# EAGLE design laserbox-muxboard (EAGLE 6.6.0)

## Sheet 1 of 2: Logic
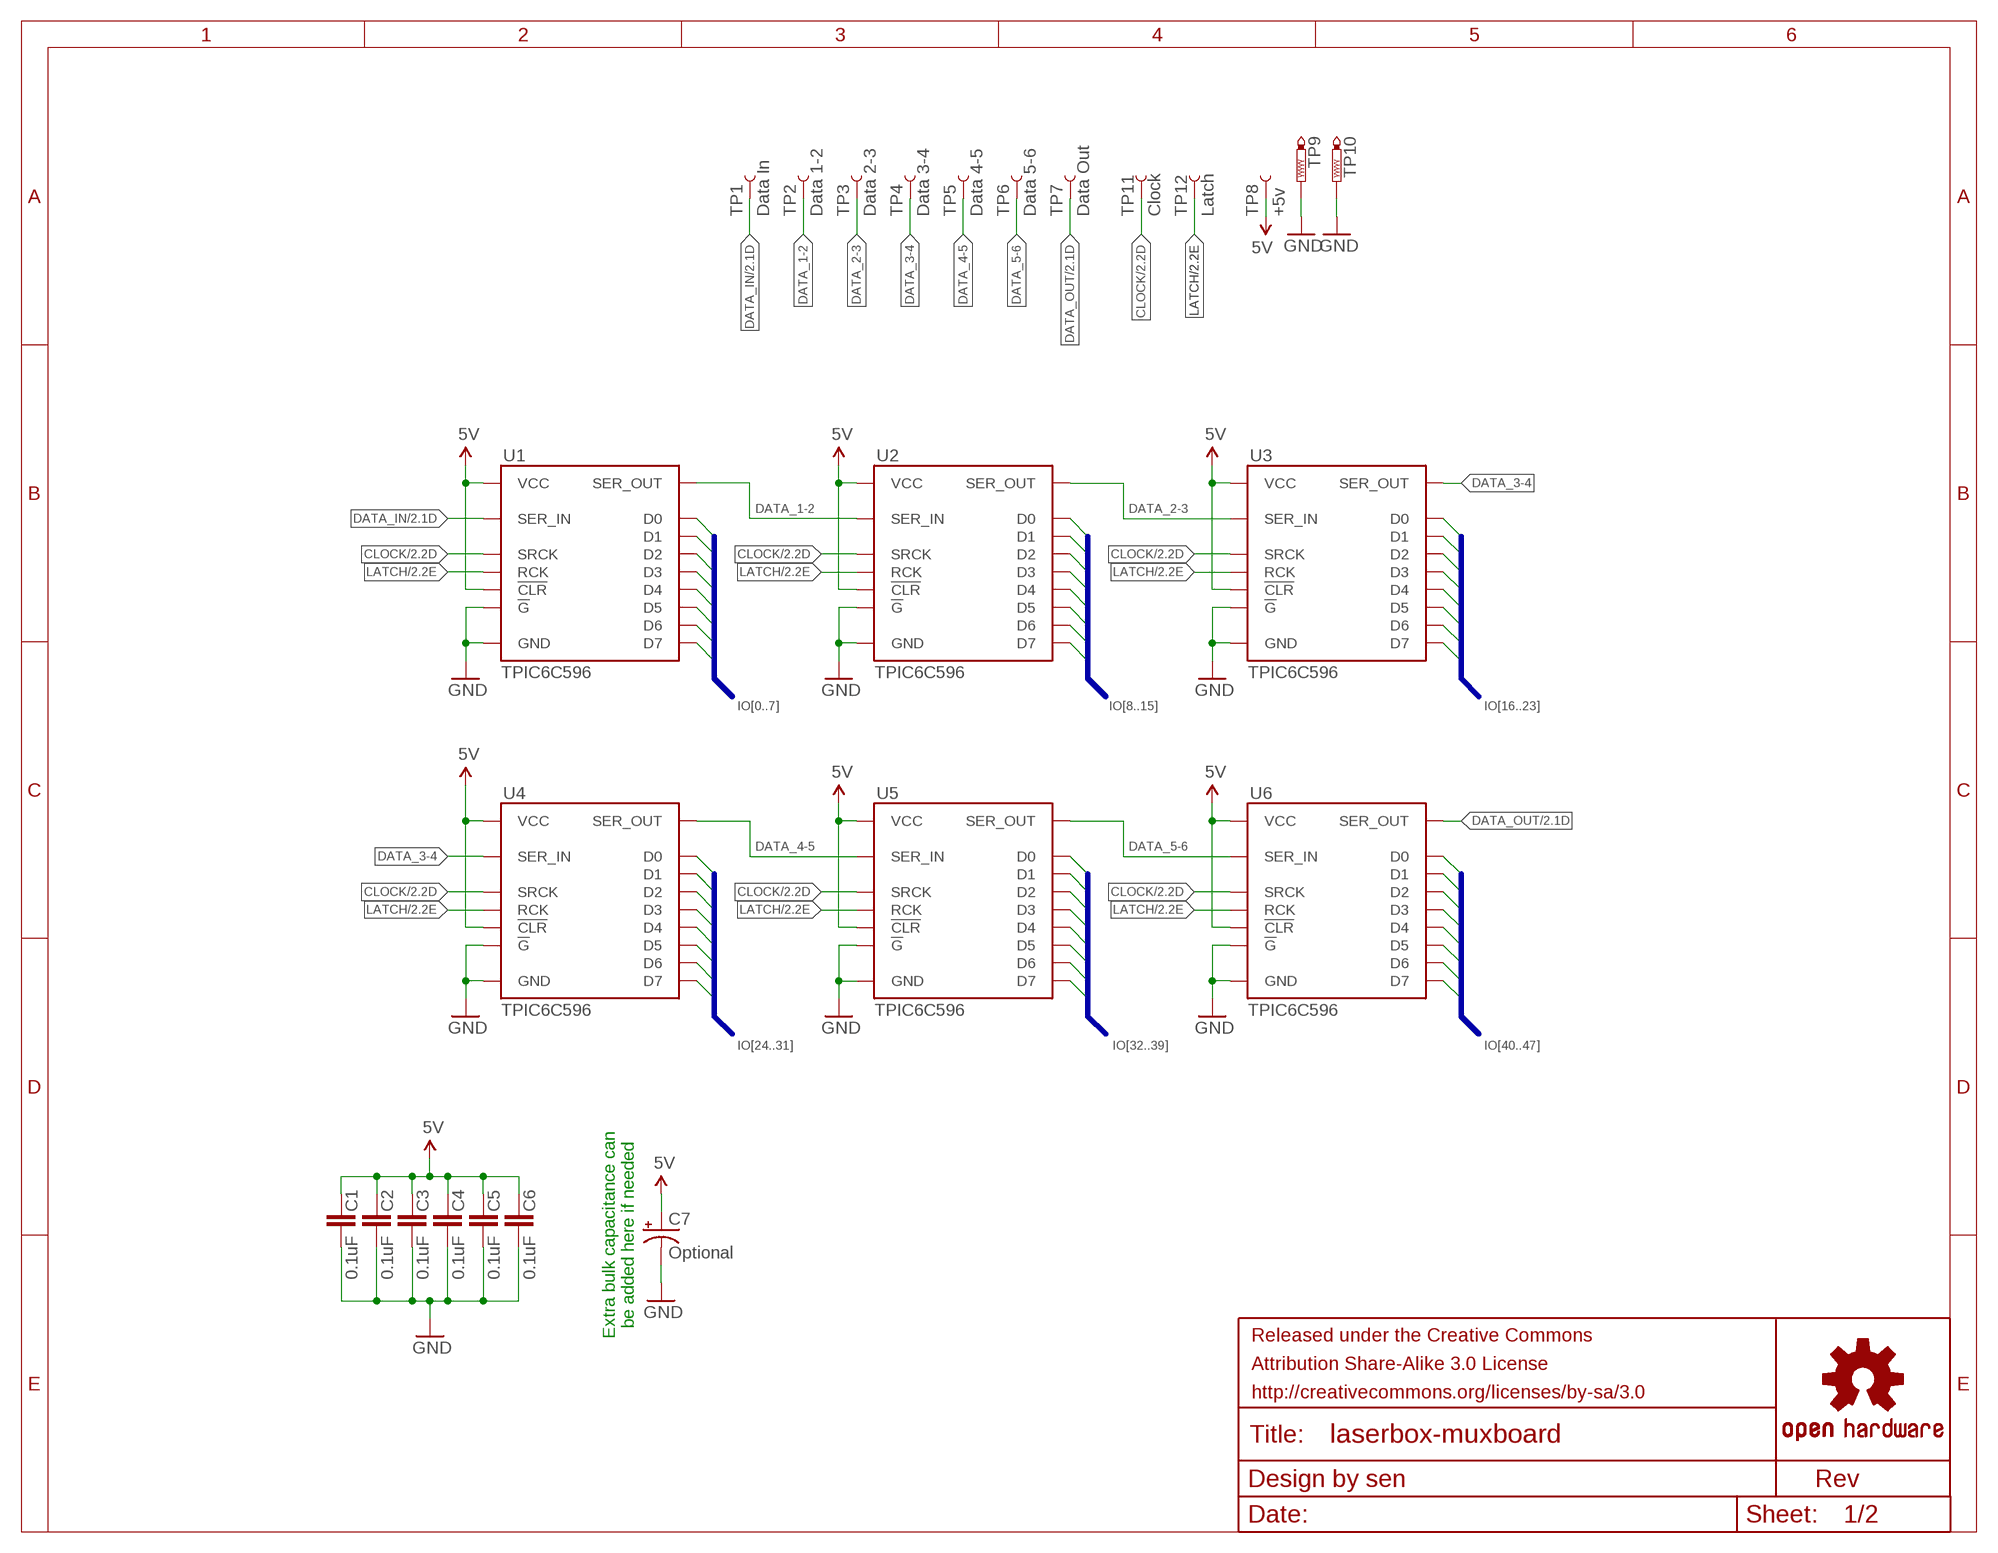
[diagram p0: schematic, sheet 1]

### Parts
C1  0.1uF  0.1UF-25V-5%(0603)  [0603-CAP]
C2  0.1uF  0.1UF-25V-5%(0603)  [0603-CAP]
C3  0.1uF  0.1UF-25V-5%(0603)  [0603-CAP]
C4  0.1uF  0.1UF-25V-5%(0603)  [0603-CAP]
C5  0.1uF  0.1UF-25V-5%(0603)  [0603-CAP]
C6  0.1uF  0.1UF-25V-5%(0603)  [0603-CAP]
C7  Optional  CAP_POLPTH2  [CPOL-RADIAL-10UF-25V]
FRAME1  FRAME-LETTER-GRID-OSHW-SENOSHW-LOGO-L  [OSHW-LOGO-L]
TP1  Data In  TEST-POINT3X5  [PAD.03X.05]
TP2  Data 1-2  TEST-POINT3X5  [PAD.03X.05]
TP3  Data 2-3  TEST-POINT3X5  [PAD.03X.05]
TP4  Data 3-4  TEST-POINT3X5  [PAD.03X.05]
TP5  Data 4-5  TEST-POINT3X5  [PAD.03X.05]
TP6  Data 5-6  TEST-POINT3X5  [PAD.03X.05]
TP7  Data Out  TEST-POINT3X5  [PAD.03X.05]
TP8  +5v  TEST-POINT3X5  [PAD.03X.05]
TP9  GND  PTR1PAD1-13  [P1-13]
TP10  GND  PTR1PAD1-13  [P1-13]
TP11  Clock  TEST-POINT3X5  [PAD.03X.05]
TP12  Latch  TEST-POINT3X5  [PAD.03X.05]
U1  TPIC6C596  TPIC6C596SOIC  [SO016]
U2  TPIC6C596  TPIC6C596SOIC  [SO016]
U3  TPIC6C596  TPIC6C596SOIC  [SO016]
U4  TPIC6C596  TPIC6C596SOIC  [SO016]
U5  TPIC6C596  TPIC6C596SOIC  [SO016]
U6  TPIC6C596  TPIC6C596SOIC  [SO016]

### Nets
5V: C1.1 C2.1 C3.1 C4.1 C5.1 C6.1 C7.1(+) TP8.P$1 U1.1(VCC) U1.7(!CLR) U2.1(VCC) U2.7(!CLR) U3.1(VCC) U3.7(!CLR) U4.1(VCC) U4.7(!CLR) U5.1(VCC) U5.7(!CLR) U6.1(VCC) U6.7(!CLR) ; also sheet 2
CLOCK: TP11.P$1 U1.15(SRCK) U2.15(SRCK) U3.15(SRCK) U4.15(SRCK) U5.15(SRCK) U6.15(SRCK) ; also sheet 2
DATA_1-2: TP2.P$1 U1.9(SER_OUT) U2.2(SER_IN)
DATA_2-3: TP3.P$1 U2.9(SER_OUT) U3.2(SER_IN)
DATA_3-4: TP4.P$1 U3.9(SER_OUT) U4.2(SER_IN)
DATA_4-5: TP5.P$1 U4.9(SER_OUT) U5.2(SER_IN)
DATA_5-6: TP6.P$1 U5.9(SER_OUT) U6.2(SER_IN)
DATA_IN: TP1.P$1 U1.2(SER_IN) ; also sheet 2
DATA_OUT: TP7.P$1 U6.9(SER_OUT) ; also sheet 2
GND: C1.2 C2.2 C3.2 C4.2 C5.2 C6.2 C7.2(-) TP9.TP TP10.TP U1.8(!G) U1.16(GND) U2.8(!G) U2.16(GND) U3.8(!G) U3.16(GND) U4.8(!G) U4.16(GND) U5.8(!G) U5.16(GND) U6.8(!G) U6.16(GND) ; also sheet 2
IO0: U1.3(D0) ; also sheet 2
IO1: U1.4(D1) ; also sheet 2
IO2: U1.5(D2) ; also sheet 2
IO3: U1.6(D3) ; also sheet 2
IO4: U1.11(D4) ; also sheet 2
IO5: U1.12(D5) ; also sheet 2
IO6: U1.13(D6) ; also sheet 2
IO7: U1.14(D7) ; also sheet 2
IO8: U2.3(D0) ; also sheet 2
IO9: U2.4(D1) ; also sheet 2
IO10: U2.5(D2) ; also sheet 2
IO11: U2.6(D3) ; also sheet 2
IO12: U2.11(D4) ; also sheet 2
IO13: U2.12(D5) ; also sheet 2
IO14: U2.13(D6) ; also sheet 2
IO15: U2.14(D7) ; also sheet 2
IO16: U3.3(D0) ; also sheet 2
IO17: U3.4(D1) ; also sheet 2
IO18: U3.5(D2) ; also sheet 2
IO19: U3.6(D3) ; also sheet 2
IO20: U3.11(D4) ; also sheet 2
IO21: U3.12(D5) ; also sheet 2
IO22: U3.13(D6) ; also sheet 2
IO23: U3.14(D7) ; also sheet 2
IO24: U4.3(D0) ; also sheet 2
IO25: U4.4(D1) ; also sheet 2
IO26: U4.5(D2) ; also sheet 2
IO27: U4.6(D3) ; also sheet 2
IO28: U4.11(D4) ; also sheet 2
IO29: U4.12(D5) ; also sheet 2
IO30: U4.13(D6) ; also sheet 2
IO31: U4.14(D7) ; also sheet 2
IO32: U5.3(D0) ; also sheet 2
IO33: U5.4(D1) ; also sheet 2
IO34: U5.5(D2) ; also sheet 2
IO35: U5.6(D3) ; also sheet 2
IO36: U5.11(D4) ; also sheet 2
IO37: U5.12(D5) ; also sheet 2
IO38: U5.13(D6) ; also sheet 2
IO39: U5.14(D7) ; also sheet 2
IO40: U6.3(D0) ; also sheet 2
IO41: U6.4(D1) ; also sheet 2
IO42: U6.5(D2) ; also sheet 2
IO43: U6.6(D3) ; also sheet 2
IO44: U6.11(D4) ; also sheet 2
IO45: U6.12(D5) ; also sheet 2
IO46: U6.13(D6) ; also sheet 2
IO47: U6.14(D7) ; also sheet 2
LATCH: TP12.P$1 U1.10(RCK) U2.10(RCK) U3.10(RCK) U4.10(RCK) U5.10(RCK) U6.10(RCK) ; also sheet 2

### Buses
IO[0..7]
IO[8..15]
IO[16..23]
IO[24..31]
IO[32..39]
IO[40..47]

### Notes on the sheet
- Extra bulk capacitance can
  be added here if needed

## Sheet 2 of 2: Status + I/O
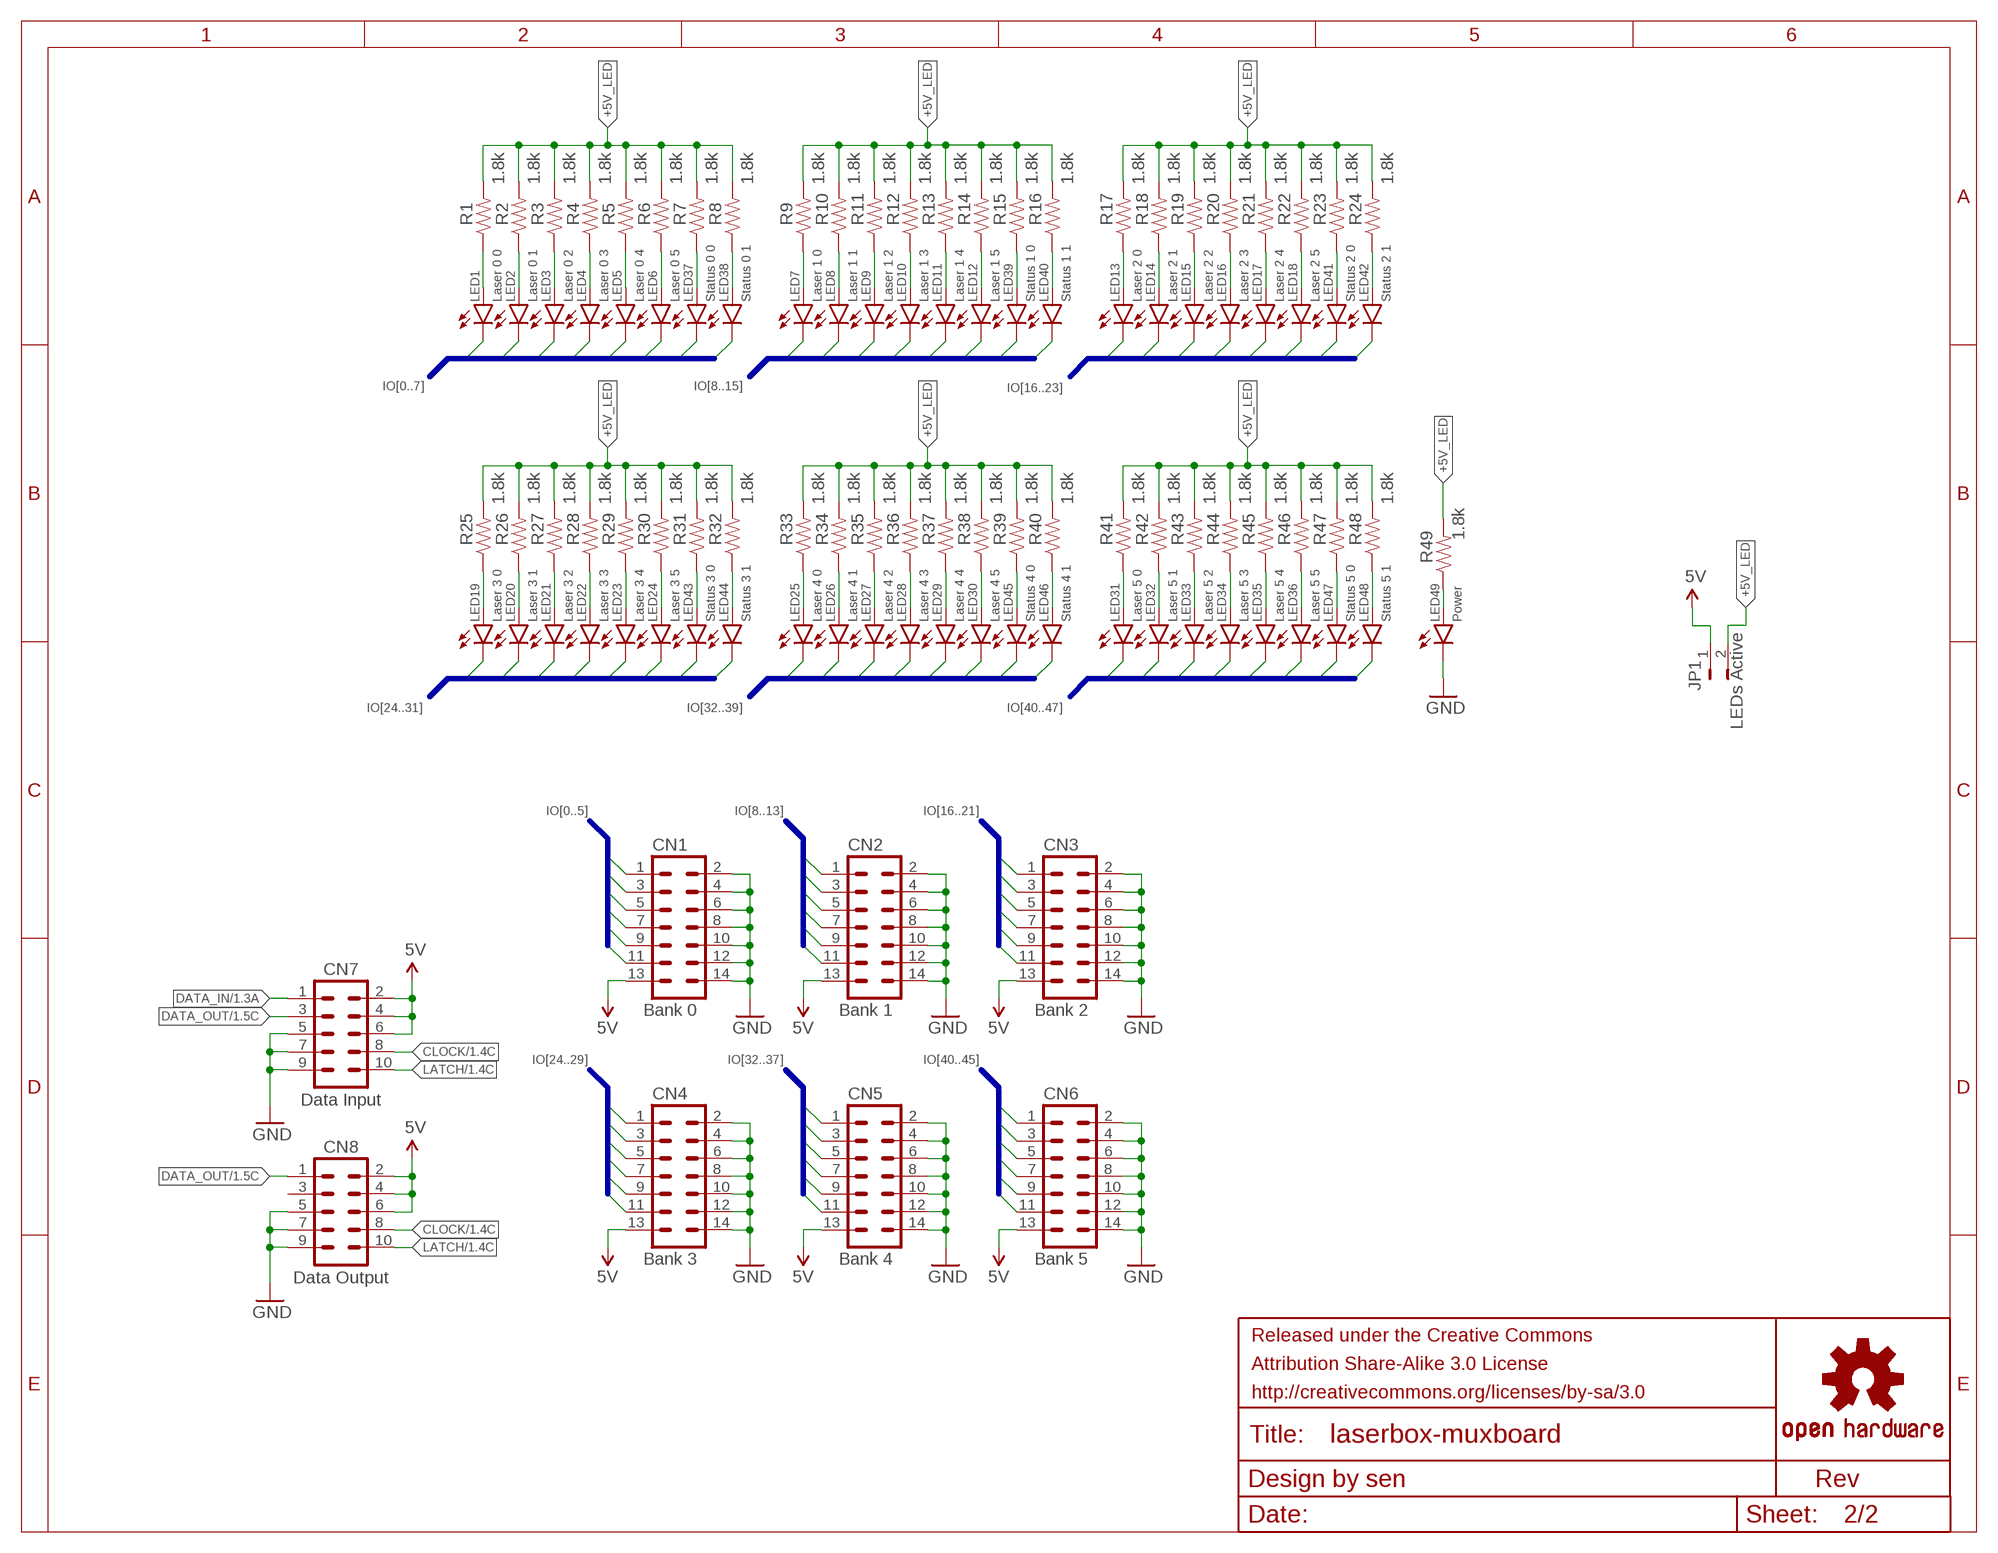
[diagram p1: schematic, sheet 2]

### Parts
CN1  Bank 0  M07X2  [2X7-SHROUDED_LOCK]
CN2  Bank 1  M07X2  [2X7-SHROUDED_LOCK]
CN3  Bank 2  M07X2  [2X7-SHROUDED_LOCK]
CN4  Bank 3  M07X2  [2X7-SHROUDED_LOCK]
CN5  Bank 4  M07X2  [2X7-SHROUDED_LOCK]
CN6  Bank 5  M07X2  [2X7-SHROUDED_LOCK]
CN7  Data Input  M05X2SHD_LOCK  [2X5-SHROUDED_LOCK]
CN8  Data Output  M05X2SHD_LOCK  [2X5-SHROUDED_LOCK]
FRAME2  FRAME-LETTER-GRID-OSHW-SENOSHW-LOGO-L  [OSHW-LOGO-L]
JP1  LEDs Active  JUMPER-PTH-2-NO  [PTH-JUMPER-2-NO_NO_SILK]
LED1  Laser 0 0  LED3MM  [LED3MM]
LED2  Laser 0 1  LED3MM  [LED3MM]
LED3  Laser 0 2  LED3MM  [LED3MM]
LED4  Laser 0 3  LED3MM  [LED3MM]
LED5  Laser 0 4  LED3MM  [LED3MM]
LED6  Laser 0 5  LED3MM  [LED3MM]
LED7  Laser 1 0  LED3MM  [LED3MM]
LED8  Laser 1 1  LED3MM  [LED3MM]
LED9  Laser 1 2  LED3MM  [LED3MM]
LED10  Laser 1 3  LED3MM  [LED3MM]
LED11  Laser 1 4  LED3MM  [LED3MM]
LED12  Laser 1 5  LED3MM  [LED3MM]
LED13  Laser 2 0  LED3MM  [LED3MM]
LED14  Laser 2 1  LED3MM  [LED3MM]
LED15  Laser 2 2  LED3MM  [LED3MM]
LED16  Laser 2 3  LED3MM  [LED3MM]
LED17  Laser 2 4  LED3MM  [LED3MM]
LED18  Laser 2 5  LED3MM  [LED3MM]
LED19  Laser 3 0  LED3MM  [LED3MM]
LED20  Laser 3 1  LED3MM  [LED3MM]
LED21  Laser 3 2  LED3MM  [LED3MM]
LED22  Laser 3 3  LED3MM  [LED3MM]
LED23  Laser 3 4  LED3MM  [LED3MM]
LED24  Laser 3 5  LED3MM  [LED3MM]
LED25  Laser 4 0  LED3MM  [LED3MM]
LED26  Laser 4 1  LED3MM  [LED3MM]
LED27  Laser 4 2  LED3MM  [LED3MM]
LED28  Laser 4 3  LED3MM  [LED3MM]
LED29  Laser 4 4  LED3MM  [LED3MM]
LED30  Laser 4 5  LED3MM  [LED3MM]
LED31  Laser 5 0  LED3MM  [LED3MM]
LED32  Laser 5 1  LED3MM  [LED3MM]
LED33  Laser 5 2  LED3MM  [LED3MM]
LED34  Laser 5 3  LED3MM  [LED3MM]
LED35  Laser 5 4  LED3MM  [LED3MM]
LED36  Laser 5 5  LED3MM  [LED3MM]
LED37  Status 0 0  LED3MM  [LED3MM]
LED38  Status 0 1  LED3MM  [LED3MM]
LED39  Status 1 0  LED3MM  [LED3MM]
LED40  Status 1 1  LED3MM  [LED3MM]
LED41  Status 2 0  LED3MM  [LED3MM]
LED42  Status 2 1  LED3MM  [LED3MM]
LED43  Status 3 0  LED3MM  [LED3MM]
LED44  Status 3 1  LED3MM  [LED3MM]
LED45  Status 4 0  LED3MM  [LED3MM]
LED46  Status 4 1  LED3MM  [LED3MM]
LED47  Status 5 0  LED3MM  [LED3MM]
LED48  Status 5 1  LED3MM  [LED3MM]
LED49  Power  LED3MM  [LED3MM]
R1  1.8k  RESISTOR0603  [0603-RES]
R2  1.8k  RESISTOR0603  [0603-RES]
R3  1.8k  RESISTOR0603  [0603-RES]
R4  1.8k  RESISTOR0603  [0603-RES]
R5  1.8k  RESISTOR0603  [0603-RES]
R6  1.8k  RESISTOR0603  [0603-RES]
R7  1.8k  RESISTOR0603  [0603-RES]
R8  1.8k  RESISTOR0603  [0603-RES]
R9  1.8k  RESISTOR0603  [0603-RES]
R10  1.8k  RESISTOR0603  [0603-RES]
R11  1.8k  RESISTOR0603  [0603-RES]
R12  1.8k  RESISTOR0603  [0603-RES]
R13  1.8k  RESISTOR0603  [0603-RES]
R14  1.8k  RESISTOR0603  [0603-RES]
R15  1.8k  RESISTOR0603  [0603-RES]
R16  1.8k  RESISTOR0603  [0603-RES]
R17  1.8k  RESISTOR0603  [0603-RES]
R18  1.8k  RESISTOR0603  [0603-RES]
R19  1.8k  RESISTOR0603  [0603-RES]
R20  1.8k  RESISTOR0603  [0603-RES]
R21  1.8k  RESISTOR0603  [0603-RES]
R22  1.8k  RESISTOR0603  [0603-RES]
R23  1.8k  RESISTOR0603  [0603-RES]
R24  1.8k  RESISTOR0603  [0603-RES]
R25  1.8k  RESISTOR0603  [0603-RES]
R26  1.8k  RESISTOR0603  [0603-RES]
R27  1.8k  RESISTOR0603  [0603-RES]
R28  1.8k  RESISTOR0603  [0603-RES]
R29  1.8k  RESISTOR0603  [0603-RES]
R30  1.8k  RESISTOR0603  [0603-RES]
R31  1.8k  RESISTOR0603  [0603-RES]
R32  1.8k  RESISTOR0603  [0603-RES]
R33  1.8k  RESISTOR0603  [0603-RES]
R34  1.8k  RESISTOR0603  [0603-RES]
R35  1.8k  RESISTOR0603  [0603-RES]
R36  1.8k  RESISTOR0603  [0603-RES]
R37  1.8k  RESISTOR0603  [0603-RES]
R38  1.8k  RESISTOR0603  [0603-RES]
R39  1.8k  RESISTOR0603  [0603-RES]
R40  1.8k  RESISTOR0603  [0603-RES]
R41  1.8k  RESISTOR0603  [0603-RES]
R42  1.8k  RESISTOR0603  [0603-RES]
R43  1.8k  RESISTOR0603  [0603-RES]
R44  1.8k  RESISTOR0603  [0603-RES]
R45  1.8k  RESISTOR0603  [0603-RES]
R46  1.8k  RESISTOR0603  [0603-RES]
R47  1.8k  RESISTOR0603  [0603-RES]
R48  1.8k  RESISTOR0603  [0603-RES]
R49  1.8k  RESISTOR0603  [0603-RES]

### Nets
5V: CN1.13 CN2.13 CN3.13 CN4.13 CN5.13 CN6.13 CN7.2 CN7.4 CN7.6 CN8.2 CN8.4 CN8.6 JP1.1 ; also sheet 1
+5V_LED: JP1.2 R1.2 R2.2 R3.2 R4.2 R5.2 R6.2 R7.2 R8.2 R9.2 R10.2 R11.2 R12.2 R13.2 R14.2 R15.2 R16.2 R17.2 R18.2 R19.2 R20.2 R21.2 R22.2 R23.2 R24.2 R25.2 R26.2 R27.2 R28.2 R29.2 R30.2 R31.2 R32.2 R33.2 R34.2 R35.2 R36.2 R37.2 R38.2 R39.2 R40.2 R41.2 R42.2 R43.2 R44.2 R45.2 R46.2 R47.2 R48.2 R49.2
CLOCK: CN7.8 CN8.8 ; also sheet 1
DATA_IN: CN7.1 ; also sheet 1
DATA_OUT: CN7.3 CN8.1 ; also sheet 1
GND: CN1.2 CN1.4 CN1.6 CN1.8 CN1.10 CN1.12 CN1.14 CN2.2 CN2.4 CN2.6 CN2.8 CN2.10 CN2.12 CN2.14 CN3.2 CN3.4 CN3.6 CN3.8 CN3.10 CN3.12 CN3.14 CN4.2 CN4.4 CN4.6 CN4.8 CN4.10 CN4.12 CN4.14 CN5.2 CN5.4 CN5.6 CN5.8 CN5.10 CN5.12 CN5.14 CN6.2 CN6.4 CN6.6 CN6.8 CN6.10 CN6.12 CN6.14 CN7.5 CN7.7 CN7.9 CN8.5 CN8.7 CN8.9 LED49.K(C) ; also sheet 1
IO0: CN1.1 LED1.K(C) ; also sheet 1
IO1: CN1.3 LED2.K(C) ; also sheet 1
IO2: CN1.5 LED3.K(C) ; also sheet 1
IO3: CN1.7 LED4.K(C) ; also sheet 1
IO4: CN1.9 LED5.K(C) ; also sheet 1
IO5: CN1.11 LED6.K(C) ; also sheet 1
IO6: LED37.K(C) ; also sheet 1
IO7: LED38.K(C) ; also sheet 1
IO8: CN2.1 LED7.K(C) ; also sheet 1
IO9: CN2.3 LED8.K(C) ; also sheet 1
IO10: CN2.5 LED9.K(C) ; also sheet 1
IO11: CN2.7 LED10.K(C) ; also sheet 1
IO12: CN2.9 LED11.K(C) ; also sheet 1
IO13: CN2.11 LED12.K(C) ; also sheet 1
IO14: LED39.K(C) ; also sheet 1
IO15: LED40.K(C) ; also sheet 1
IO16: CN3.1 LED13.K(C) ; also sheet 1
IO17: CN3.3 LED14.K(C) ; also sheet 1
IO18: CN3.5 LED15.K(C) ; also sheet 1
IO19: CN3.7 LED16.K(C) ; also sheet 1
IO20: CN3.9 LED17.K(C) ; also sheet 1
IO21: CN3.11 LED18.K(C) ; also sheet 1
IO22: LED41.K(C) ; also sheet 1
IO23: LED42.K(C) ; also sheet 1
IO24: CN4.1 LED19.K(C) ; also sheet 1
IO25: CN4.3 LED20.K(C) ; also sheet 1
IO26: CN4.5 LED21.K(C) ; also sheet 1
IO27: CN4.7 LED22.K(C) ; also sheet 1
IO28: CN4.9 LED23.K(C) ; also sheet 1
IO29: CN4.11 LED24.K(C) ; also sheet 1
IO30: LED43.K(C) ; also sheet 1
IO31: LED44.K(C) ; also sheet 1
IO32: CN5.1 LED25.K(C) ; also sheet 1
IO33: CN5.3 LED26.K(C) ; also sheet 1
IO34: CN5.5 LED27.K(C) ; also sheet 1
IO35: CN5.7 LED28.K(C) ; also sheet 1
IO36: CN5.9 LED29.K(C) ; also sheet 1
IO37: CN5.11 LED30.K(C) ; also sheet 1
IO38: LED45.K(C) ; also sheet 1
IO39: LED46.K(C) ; also sheet 1
IO40: CN6.1 LED31.K(C) ; also sheet 1
IO41: CN6.3 LED32.K(C) ; also sheet 1
IO42: CN6.5 LED33.K(C) ; also sheet 1
IO43: CN6.7 LED34.K(C) ; also sheet 1
IO44: CN6.9 LED35.K(C) ; also sheet 1
IO45: CN6.11 LED36.K(C) ; also sheet 1
IO46: LED47.K(C) ; also sheet 1
IO47: LED48.K(C) ; also sheet 1
LATCH: CN7.10 CN8.10 ; also sheet 1
LED1_R: LED1.A R1.1
LED2_R: LED2.A R2.1
LED3_R: LED3.A R3.1
LED4_R: LED4.A R4.1
LED5_R: LED5.A R5.1
LED6_R: LED6.A R6.1
LED7_R: LED7.A R9.1
LED8_R: LED8.A R10.1
LED9_R: LED9.A R11.1
LED10_R: LED10.A R12.1
LED11_R: LED11.A R13.1
LED12_R: LED12.A R14.1
LED13_R: LED13.A R17.1
LED14_R: LED14.A R18.1
LED15_R: LED15.A R19.1
LED16_R: LED16.A R20.1
LED17_R: LED17.A R21.1
LED18_R: LED18.A R22.1
LED19_R: LED19.A R25.1
LED20_R: LED20.A R26.1
LED21_R: LED21.A R27.1
LED22_R: LED22.A R28.1
LED23_R: LED23.A R29.1
LED24_R: LED24.A R30.1
LED25_R: LED25.A R33.1
LED26_R: LED26.A R34.1
LED27_R: LED27.A R35.1
LED28_R: LED28.A R36.1
LED29_R: LED29.A R37.1
LED30_R: LED30.A R38.1
LED31_R: LED31.A R41.1
LED32_R: LED32.A R42.1
LED33_R: LED33.A R43.1
LED34_R: LED34.A R44.1
LED35_R: LED35.A R45.1
LED36_R: LED36.A R46.1
LED37_R: LED37.A R7.1
LED38_R: LED38.A R8.1
LED39_R: LED39.A R15.1
LED40_R: LED40.A R16.1
LED41_R: LED41.A R23.1
LED42_R: LED42.A R24.1
LED43_R: LED43.A R31.1
LED44_R: LED44.A R32.1
LED45_R: LED45.A R39.1
LED46_R: LED46.A R40.1
LED47_R: LED47.A R47.1
LED48_R: LED48.A R48.1
LED49_R: LED49.A R49.1
Unconnected: CN8.3

### Buses
IO[0..7]
IO[8..15]
IO[16..23]
IO[24..31]
IO[32..39]
IO[40..47]
IO[0..5]
IO[8..13]
IO[16..21]
IO[24..29]
IO[32..37]
IO[40..45]

## Library data of the parts
C1-C6 = SparkFun-Capacitors:0.1UF-25V-5%(0603): CAP-08604; PROD_ID: CAP-08604
C7 = SparkFun-Capacitors:CAP_POL: Capacitor Polarized These are standard SMD and PTH capacitors. Normally 10uF, 47uF, and 100uF in electrolytic and tantalum varieties. Always verify the external diameter of the through hole cap, it varies with capacity, voltage, and manufacturer. The EIA devices should be standard.
CN1-CN6 = con-sen:M07X2: 2x7 0.1" pin header connector
CN7 CN8 = SparkFun-Connectors:M05X2: Header 5x2 Standard 10-pin dual row 0.1" header. Commonly used with AVR-ISP. Use with Spark Fun Electronics SKU: PRT-00778
FRAME1 FRAME2 = logos-sen:FRAME-LETTER-GRID-OSHW-SEN: Landscape letter-sized schematic frame w/ OSHW logo, edge grid; REV: 001
JP1 = SparkFun-Passives:JUMPER-PTH-2-NO
LED1-LED49 = SparkFun-LED:LED: LEDs Standard schematic elements and footprints for 5mm, 3mm, 1206, and 0603 sized LEDs. 5mm - Spark Fun Electronics SKU : COM-00529 (and others); PROD_ID: DIO-08794
R1-R49 = SparkFun-Resistors:RESISTOR: Resistor Basic schematic elements and footprints for 0603, 1206, and PTH resistors.
TP1-TP8 TP11 TP12 = SparkFun-Passives:TEST-POINT: Bare copper test points for troubleshooting or ICT
TP9 TP10 = testpad:PTR1: TEST PIN
U1-U6 = SparkFun-DigitalIC:TPIC6C596: SMD version of the popular sink driver. This version can sink up to 100mA per channel; PROD_ID: IC-12522

## Board
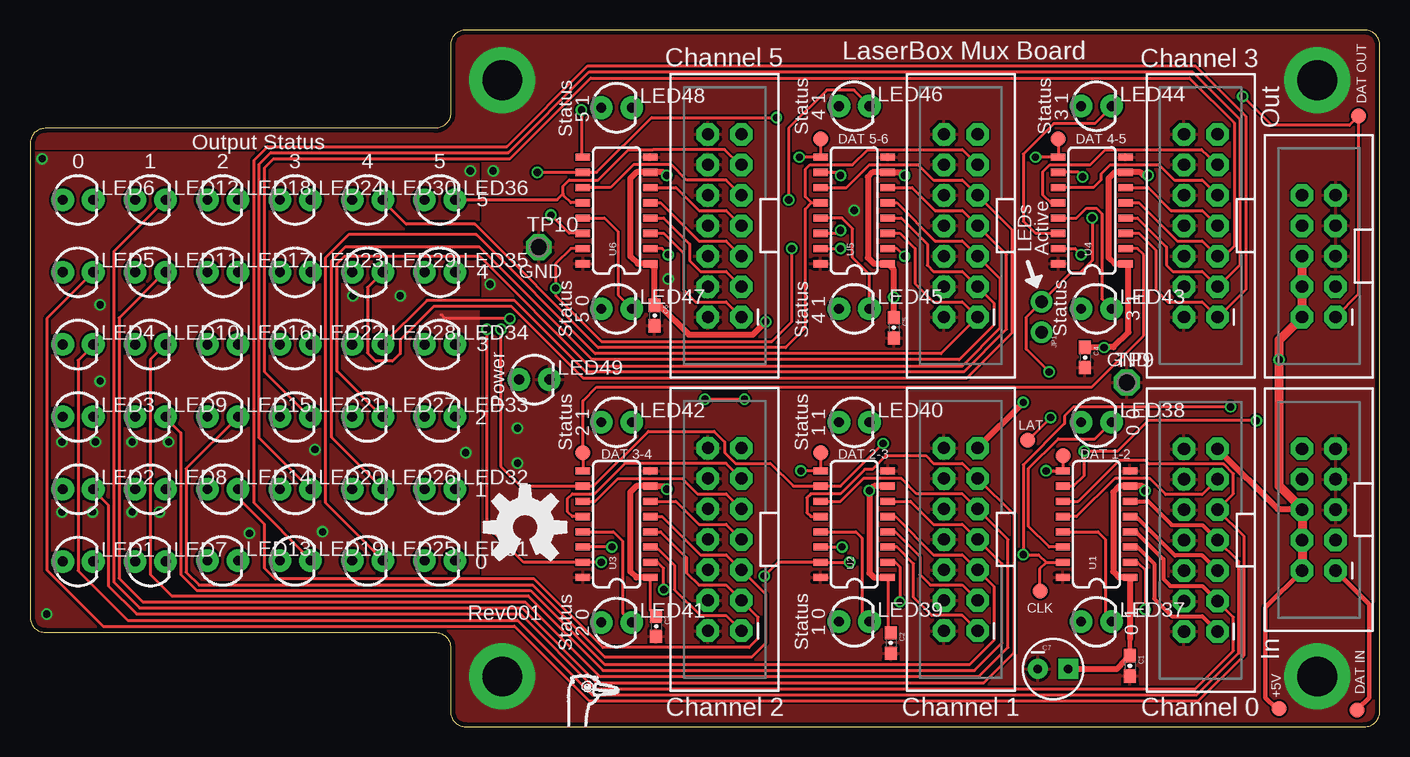
[diagram p2: board, top side]
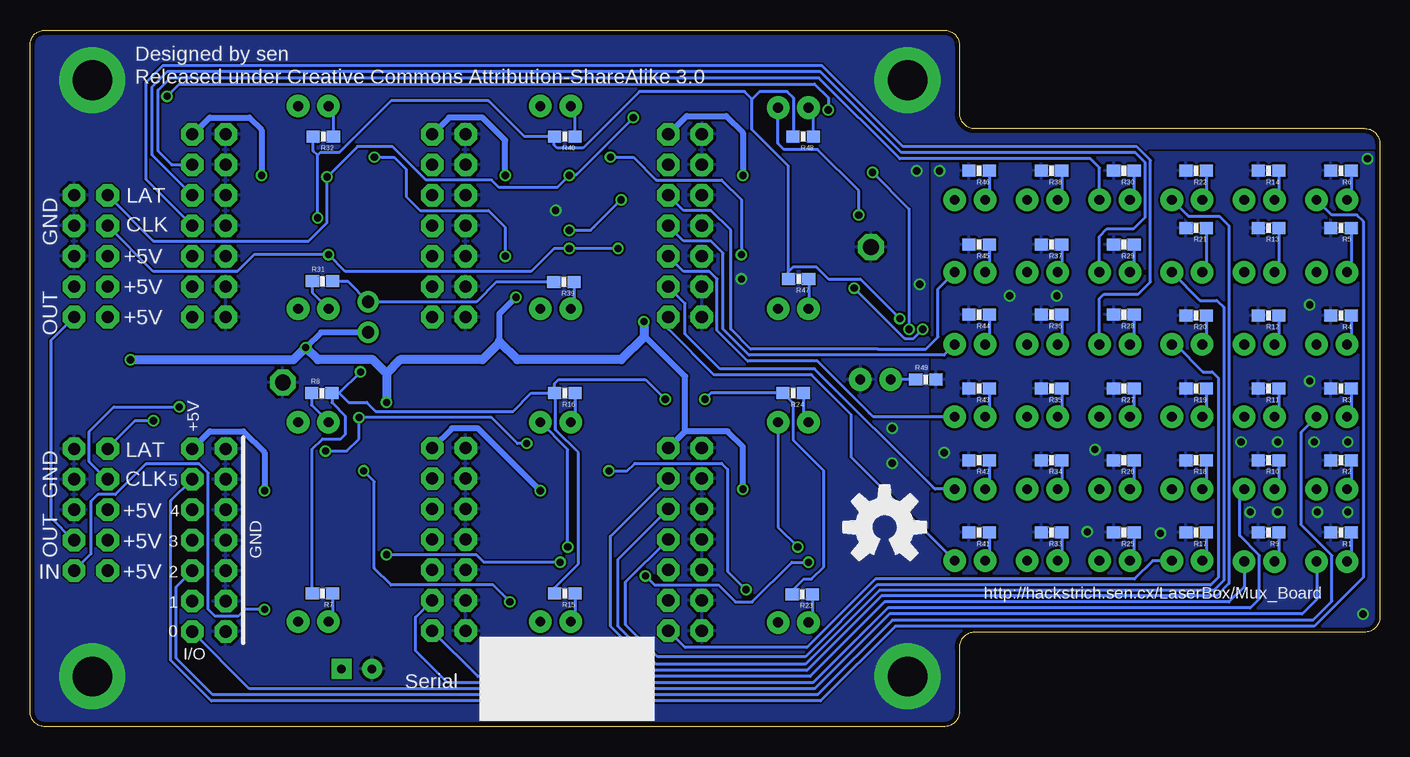
[diagram p3: board, bottom side, seen from below]

Size 112.52 x 58.1 mm. Coordinates in mm from the lower left corner, seen from the top.
Outline: 111.25,58.1 36.32,58.1 arc90 35.05,56.83 35.05,51.17 arc-90 33.78,49.9 1.27,49.9 arc90 0,48.63 0,9.14 arc90 1.27,7.87 33.78,7.87 arc-90 35.05,6.6 35.05,1.27 arc90 36.32,0 111.25,0 arc90 112.52,1.27 112.52,56.83 arc90 111.25,58.1
Copper layers (1*16): Top 0.0356mm / dielectric 1.5011mm / Bottom 0.0356mm
Design rules "LaenPCBOrder-sen *": minimum track width 6mil, minimum drill 13mil, track to track 6mil, track to pad 6mil, pad to pad 6mil, via to via 6mil, smd to smd 6mil, copper to edge 15mil, drill to drill 6mil, minimum pad ring 7mil, minimum via ring 7mil, stop-mask expansion 4mil, vias tented up to drill 25mil, thermal gap 10mil

### Footprints (pad centres in the part's own frame; a part is rotated, then mirrored left to right if it is on the bottom)
0603-CAP = smd 1.1 x 1: 1 -0.85,0; 2 0.85,0
CPOL-RADIAL-10UF-25V = drill 0.7 pad 1.651 square: 1 1.27,0 | drill 0.7 pad 1.651: 2 -1.27,0
2X7-SHROUDED_LOCK = drill 1.016 pad 1.88 octagon: 1 -1.397,7.62; 2 1.397,7.62; 3 -1.397,5.08; 4 1.397,5.08; 5 -1.397,2.54; 6 1.397,2.54; 7 -1.397,0; 8 1.397,0; 9 -1.397,-2.54; 10 1.397,-2.54; 11 -1.397,-5.08; 12 1.397,-5.08; 13 -1.397,-7.62; 14 1.397,-7.62
2X5-SHROUDED_LOCK = drill 1.016 pad 1.88 octagon: 1 -1.397,5.08; 2 1.397,5.08; 3 -1.397,2.54; 4 1.397,2.54; 5 -1.397,0; 6 1.397,0; 7 -1.397,-2.54; 8 1.397,-2.54; 9 -1.397,-5.08; 10 1.397,-5.08
PTH-JUMPER-2-NO_NO_SILK = drill 1.016 pad 1.778: 1 -1.27,0; 2 1.27,0
LED3MM = drill 0.813 pad 1.88: A -1.27,0; K 1.27,0
0603-RES = smd 1.1 x 1: 1 -0.85,0; 2 0.85,0
PAD.03X.05 = smd 1.27 x 1.27: P$1 0,0
P1-13 = drill 1.321 pad 2.159 octagon: TP 0,0
SO016 = smd 0.6 x 1.2: 1 -4.445,-2.8; 2 -3.175,-2.8; 3 -1.905,-2.8; 4 -0.635,-2.8; 5 0.635,-2.8; 6 1.905,-2.8; 7 3.175,-2.8; 8 4.445,-2.8; 9 4.445,2.8; 10 3.175,2.8; 11 1.905,2.8; 12 0.635,2.8; 13 -0.635,2.8; 14 -1.905,2.8; 15 -3.175,2.8; 16 -4.445,2.8

### Placement (x,y rotation side)
C1  91.69,5.08 270 top
C2  71.75,6.99 270 top
C3  52.2,8.38 270 top
C4  87.95,30.8 270 top
C5  72.01,33.27 270 top
C6  52.07,34.29 270 top
C7  85.28,4.83 0 top
CN1  97.6,15.56 180 top
CN2  77.6,15.62 180 top
CN3  57.91,15.62 180 top
CN4  97.6,41.78 180 top
CN5  77.6,41.78 180 top
CN6  57.91,41.78 180 top
CN7  107.44,18.1 180 top
CN8  107.44,39.24 180 top
FRAME1  41.27,16.64 0 bottom
FRAME2  41.27,16.64 0 top
JP1  84.33,34.16 90 top
LED1  4,13.78 0 top
LED2  4,19.81 0 top
LED3  4,25.84 0 top
LED4  4,31.88 0 top
LED5  4,37.91 0 top
LED6  4,43.94 0 top
LED7  10.03,13.78 0 top
LED8  10.03,19.81 0 top
LED9  10.03,25.84 0 top
LED10  10.03,31.88 0 top
LED11  10.03,37.91 0 top
LED12  10.03,43.94 0 top
LED13  16.07,13.84 0 top
LED14  16.07,19.81 0 top
LED15  16.07,25.84 0 top
LED16  16.07,31.88 0 top
LED17  16.07,37.91 0 top
LED18  16.07,43.94 0 top
LED19  22.1,13.84 0 top
LED20  22.1,19.81 0 top
LED21  22.1,25.84 0 top
LED22  22.1,31.88 0 top
LED23  22.1,37.91 0 top
LED24  22.1,43.94 0 top
LED25  28.13,13.84 0 top
LED26  28.13,19.81 0 top
LED27  28.13,25.84 0 top
LED28  28.13,31.88 0 top
LED29  28.13,37.91 0 top
LED30  28.13,43.94 0 top
LED31  34.16,13.84 0 top
LED32  34.16,19.81 0 top
LED33  34.16,25.84 0 top
LED34  34.16,31.88 0 top
LED35  34.16,37.91 0 top
LED36  34.16,43.94 0 top
LED37  88.9,8.76 0 top
LED38  88.9,25.4 0 top
LED39  68.71,8.76 0 top
LED40  68.71,25.4 0 top
LED41  48.9,8.7 0 top
LED42  48.9,25.4 0 top
LED43  88.9,34.86 0 top
LED44  88.9,51.75 0 top
LED45  68.71,34.86 0 top
LED46  68.71,51.75 0 top
LED47  48.9,34.86 0 top
LED48  48.9,51.63 0 top
LED49  42.04,28.96 0 top
R1  3.24,16.19 180 bottom
R2  3.24,22.23 180 bottom
R3  3.24,28.19 180 bottom
R4  3.24,34.29 180 bottom
R5  3.24,41.59 180 bottom
R6  3.24,46.35 180 bottom
R7  88.14,11.11 180 bottom
R8  88.2,27.81 0 bottom
R9  9.27,16.19 180 bottom
R10  9.27,22.23 180 bottom
R11  9.27,28.19 180 bottom
R12  9.27,34.29 180 bottom
R13  9.27,41.59 180 bottom
R14  9.27,46.35 180 bottom
R15  67.94,11.11 180 bottom
R16  67.94,27.81 180 bottom
R17  15.3,16.19 180 bottom
R18  15.3,22.23 180 bottom
R19  15.3,28.19 180 bottom
R20  15.3,34.29 180 bottom
R21  15.3,41.59 180 bottom
R22  15.3,46.35 180 bottom
R23  48.13,11.05 180 bottom
R24  48.9,27.81 180 bottom
R25  21.34,16.19 180 bottom
R26  21.34,22.23 180 bottom
R27  21.34,28.19 180 bottom
R28  21.34,34.35 180 bottom
R29  21.34,40.2 180 bottom
R30  21.34,46.35 180 bottom
R31  88.14,37.15 0 bottom
R32  88.07,49.21 180 bottom
R33  27.37,16.19 180 bottom
R34  27.37,22.23 180 bottom
R35  27.37,28.19 180 bottom
R36  27.37,34.35 180 bottom
R37  27.37,40.2 180 bottom
R38  27.37,46.35 180 bottom
R39  68.01,37.08 180 bottom
R40  67.94,49.21 180 bottom
R41  33.4,16.19 180 bottom
R42  33.4,22.23 180 bottom
R43  33.4,28.19 180 bottom
R44  33.4,34.35 180 bottom
R45  33.4,40.2 180 bottom
R46  33.4,46.35 180 bottom
R47  48.45,37.34 180 bottom
R48  48.07,49.21 180 bottom
R49  37.85,28.96 0 bottom
TP1  110.62,1.4 90 top
TP2  86.11,22.61 0 top
TP3  65.91,22.86 0 top
TP4  46.1,22.86 0 top
TP5  85.72,49.02 0 top
TP6  65.91,49.02 0 top
TP7  110.74,50.93 90 top
TP8  104.14,1.52 90 top
TP9  91.44,28.7 0 top
TP10  42.42,40.01 0 top
TP11  84.2,11.3 90 top
TP12  83.19,23.88 90 top
U1  88.9,16.89 90 top
U2  68.71,16.89 90 top
U3  48.9,16.89 90 top
U4  88.52,43.05 90 top
U5  68.71,43.05 90 top
U6  48.9,43.05 90 top
U$1  [STRICH-LOGO-R]  45.59,2.03 0 top

### Tracks (layer width: path | path; a pad name or v marks a point on that pad's centre or on a via)
5V  (via drill 0.6)
  Top 0.254: U2.7 70.36,20.07 | U2.1 71.51,8.08 C2.1 | U3.1 51.7,9.73 C3.1 | 91.57,38.36 U4.1
  Top 0.33: 90.81,12.45 90.68,12.57
  Top 0.381: TP8.P$1 103.89,1.52 103,2.41 103,9.97 CN7.2 | 91.7,7.33 C1.1 91.33,5.57
  Top 0.508: 90.68,12.57 90.3,12.95 90.3,19.56 90.81,20.07 U1.7 92.71,20.07 92.96,19.81 v92.96,19.68 | 90.81,12.45 U1.1 91.7,7.33 | U2.1 70.36,12.45 69.98,12.83 v69.98,19.68 70.36,20.07 U2.7 | U3.1 50.55,12.45 50.04,12.95 50.04,19.56 50.55,20.07 U3.7 52.83,20.07 v53.09,19.81 | U4.1 90.42,38.61 89.92,39.12 89.92,45.72 90.42,46.23 U4.7 92.58,46.23 92.84,45.97 v93.22,45.97 | C4.1 89.56,31.65 | 91.57,38.36 91.57,32.89 90.32,31.65 89.56,31.65 | C5.1 v72.01,35.81 72.01,38.11 U5.1 70.36,38.61 69.85,39.12 69.85,45.85 70.23,46.23 U5.7 72.64,46.23 v72.9,45.97 | CN1.13 104.01,18.16 105.98,18.16 CN7.6 | 89.56,31.65 v89.53,31.62 | CN2.13 v82.8,27.05 | v61.34,33.78 60.26,32.7 54.93,32.7 52.49,35.14 C6.1 52.07,38.23 U6.1 50.67,38.61 50.04,39.24 50.04,45.72 50.55,46.23 U6.7 52.83,46.23 v53.09,45.97 | C7.1 90.59,4.83 91.33,5.57 C1.1
  Top 0.762: CN7.2 CN7.4 CN7.6 106.05,18.16 104.14,20.07 v104.14,30.61 104.14,32.26 CN8.2 CN8.4 CN8.6
  Bottom 0.508: v69.98,19.68 75.18,24.89 77.34,24.89 CN2.13 | v72.01,35.81 73.41,34.42 73.41,32.13 73.41,32 | v53.09,19.81 53.09,23.37 54.36,24.64 57.91,24.64 | 57.91,24.64 CN3.13 | CN1.13 97.54,24.64 94.74,24.64 92.96,22.86 v92.96,19.68 | 57.91,24.64 57.91,29.21 61.34,32.64 v61.34,33.78 | CN4.13 98.93,49.4 97.54,50.8 94.23,50.8 93.22,49.78 v93.22,45.97 | v72.9,45.97 72.9,48.9 74.8,50.8 77.6,50.8 CN5.13 | CN6.13 57.78,50.93 54.48,50.93 53.09,49.53 v53.09,45.97 | JP1.1 88.27,32.89 v89.53,31.62
  Bottom 0.762: v104.14,30.61 90.55,30.61 v89.53,31.62 88.52,30.61 83.95,30.61 82.8,29.46 | 73.41,32 74.8,30.61 81.66,30.61 82.8,29.46 | v61.34,33.78 61.34,32.51 63.25,30.61 71.88,30.61 73.41,32.13 | 82.8,29.46 v82.8,27.05
+5V_LED  (via drill 0.6)
  Top 0.254: v88.54,42.44 88.54,38.89 87.5,37.85 86.74,37.85 JP1.2 83.06,34.16 83.06,31.5 v84.96,29.59 | v59.56,27.3 v56.26,27.3 | v40.01,34.04 34.57,34.04 R44.2
  Bottom 0.254: R15.2 68.8,11.6 66.8,13.59 66.8,22.86 68.71,24.77 68.71,27.73 R16.2 | R31.2 86.04,37.15 JP1.2 75.31,35.43 73.66,37.08 R39.2 | 88.61,48.9 R32.2 | 88.54,48.77 88.54,48.83 R32.2 | R8.2 86.74,27.81 | 86.74,27.81 v84.96,29.59 | R8.2 87.35,27.03 86.23,25.91 86.23,24.38 86.61,24 88.14,24 88.99,23.15 R7.2 | R16.2 68.8,28.61 68.45,28.96 61.21,28.96 v59.56,27.3 | v56.26,27.3 55.75,27.81 R24.2 48.9,26.96 48.9,23.88 46.35,21.34 46.35,13.34 47.37,12.32 48.01,12.32 48.98,11.34 R23.2 | 87.38,27.81 R8.2 | 86.74,27.81 85.98,27.05 84.45,27.05 83.69,26.29 72.26,26.29 70.74,27.81 R16.2 | v88.54,42.44 88.54,47.65 | 88.54,47.65 88.9,48.01 88.9,49.19 R32.2 | 88.54,47.65 88.31,47.88 86.74,47.88 82.42,52.2 74.3,52.2 71.31,49.21 R40.2 68.83,49.17 68.83,48.51 68.58,48.26 66.42,48.26 61.72,52.96 52.96,52.96 52.32,52.32 | R48.2 48.9,49.24 48.9,52.45 49.4,52.96 51.69,52.96 52.32,52.32 | v40.01,34.04 43.31,37.34 45.97,37.34 46.99,38.35 48.9,38.35 49.3,37.95 R47.2 49.3,46.76 52.32,49.78 52.32,52.32
  other vias: 36.7,46.35 1.02,47.37 36.32,22.86 24.38,16.26 23.75,23.11 18.29,16.13 5.84,28.83 5.84,35.18 11.56,23.75 8.51,23.75 5.46,23.75 2.67,17.91 5.21,17.91 8.51,17.91 2.67,23.75 30.86,35.94 26.92,35.94 10.79,17.91 1.4,9.4
  pour Bottom (isolate 0.203): 0.51,47.88 37.34,47.88 37.34,8.13 0.51,8.13
  pour Top (isolate 0.203): 0.51,47.88 37.34,47.88 37.34,8.13 0.51,8.13
CLOCK  (via drill 0.6)
  Top 0.254: v68.33,13.72 U2.15 62.36,13.72 v61.21,12.57 | 84.71,13.72 84.07,14.35 v82.8,14.35 82.8,21.84 86.23,25.27 86.23,25.91 87,26.67 99.44,26.67 | 84.71,13.72 U1.15 | v47.62,13.72 U3.15 | U3.15 | TP11.P$1 84.2,13.21 84.71,13.72 | 99.44,26.67 v100.08,26.67 99.44,26.67 | U4.15 87.12,39.88 v87.63,39.37 | U5.15 v67.56,39.88 | U6.15 45.09,39.88 43.81,38.61 v43.81,36.58 43.81,35.94 47.62,32.13 61.85,32.13 63.5,33.78 v63.5,39.88 | U3.15 41.15,13.72 38.1,16.76 v38.1,33.15
  Bottom 0.254: v68.33,13.72 74.68,13.72 75.31,14.35 v82.8,14.35 | v61.21,12.57 60.45,11.81 55.12,11.81 53.72,10.41 52.32,10.41 49.02,13.72 v47.62,13.72 | CN8.8 102.23,37.97 95.25,37.97 93.85,39.37 v87.63,39.37 86.23,37.97 70.74,37.97 68.83,39.88 v67.56,39.88 v63.5,39.88 | v43.81,36.58 39.62,32.38 38.86,32.38 v38.1,33.15 | CN7.8 106.11,20.64 107.57,22.1 107.57,24.64 105.54,26.67 v100.08,26.67
DATA_1-2  (via drill 0.6)
  Top 0.254: TP2.P$1 U1.9 85.34,21.34 v84.71,21.34 | U2.2 72.14,13.72 72.52,13.34 v72.52,10.41
  Bottom 0.254: v72.52,10.41 73.91,11.81 82.42,11.81 83.82,13.21 83.82,20.45 v84.71,21.34
DATA_2-3  (via drill 0.6)
  Top 0.254: TP3.P$1 U2.9 v64.26,21.34 | v52.83,11.43 52.83,13.21 52.32,13.72 U3.2
  Bottom 0.254: v52.83,11.43 54.36,12.95 54.36,21.46 54.86,21.97 62.1,21.97 62.74,21.34 v64.26,21.34
DATA_3-4
  Top 0.254: U3.9 TP4.P$1 46.1,27.18 47.24,28.32 88.52,28.32 92.84,32.64 92.84,39.37 92.33,39.88 U4.2
DATA_4-5  (via drill 0.6)
  Top 0.254: TP5.P$1 U4.9 v83.82,47.5 | v72.9,39.24 72.26,39.88 U5.2
  Bottom 0.254: v83.82,47.5 82.17,47.5 81.15,46.48 81.15,44.2 80.01,43.05 74.3,43.05 74.17,42.93 72.9,41.66 v72.9,39.24
DATA_5-6  (via drill 0.6)
  Top 0.254: TP6.P$1 U5.9 64.52,47.5 v64.14,47.5 | v53.21,39.37 52.7,39.88 U6.2
  Bottom 0.254: v64.14,47.5 62.23,47.5 60.33,45.59 54.86,45.59 53.21,43.94 v53.21,39.37
DATA_IN  (via drill 0.6)
  Top 0.254: U1.2 92.33,13.72 92.96,13.08 v92.96,9.78
  Top 0.381: TP1.P$1 110.74,1.52 111.63,2.41 111.63,10.22 CN7.1
  Bottom 0.254: v92.96,9.78 94.61,9.78 95.19,9.21 97.09,9.21 97.66,9.78 97.66,21.14 98.42,21.91 102.87,21.91 105.41,19.37 106.87,19.37 107.44,18.8 107.44,14.41 CN7.1
DATA_OUT  (via drill 0.6)
  Top 0.254: CN8.1 110.74,36.07 TP7.P$1 109.98,50.16 103.5,50.16 v101.09,52.58 | v45.97,51.44 45.97,47.63 45.97,47.62 U6.9
  Bottom 0.254: CN7.3 108.9,15.56 110.74,17.4 110.74,32.26 CN8.1 | v101.09,52.58 100.08,53.59 47.12,53.59 45.97,52.45 v45.97,51.44
GND  (via drill 0.6, 3.3 pad 5.5)
  other vias: 39.37,53.91 107.31,4.19 39.37,4.19 107.31,53.91 38.61,46.35 53.21,37.34 68.71,43.05 38.35,36.89 40.64,24.89 40.64,21.97
  pour Top (rank 5): 35.05,58.29 112.52,58.29 112.52,0.13 35.05,0.13 35.05,7.87 0,7.87 0,49.91 35.05,49.91
  pour Bottom (rank 2): 35.05,58.29 112.52,58.29 112.52,0.13 35.05,0.13 35.05,7.87 0,7.87 0,49.91 35.05,49.91
IO0
  Top 0.33: U1.3 92.33,14.99 93.73,13.59 93.73,10.67 95.19,9.21 97.73,9.21 CN1.1
  Bottom 0.254: LED1.K 5.27,10.6 6.48,9.4 40.89,9.4 47.12,3.17 94.23,3.17 CN1.1
IO1
  Top 0.254: LED2.K 5.27,19.75 6.54,18.48 6.54,11.75 8.89,9.4 40.89,9.4 47.12,3.17 97.16,3.17 100.33,6.35 100.33,9.14 CN1.3
  Top 0.33: 92.2,16.26 94.49,13.97 94.49,12.32 95.06,11.75 97.73,11.75 CN1.3
  Top 0.406: U1.4 92.2,16.26
IO2
  Top 0.33: CN1.5 97.73,14.29 95.44,14.29 92.2,17.53 U1.5
  Bottom 0.254: CN1.5 100.33,11.68 100.33,5.71 97.28,2.67 46.86,2.67 40.64,8.89 5.59,8.89 4,10.48 4,14.29 5.33,15.62 6.54,16.83 6.54,24.57 LED3.K
IO3
  Top 0.254: LED4.K 5.27,31.81 4,30.54 4,13.02 8.13,8.89 40.64,8.89 46.86,2.67 97.28,2.67 100.78,6.16 100.78,13.78 CN1.7
  Top 0.33: U1.6 93.22,18.8 94.74,17.27 95.19,16.83 97.73,16.83 CN1.7
IO4
  Top 0.254: LED5.K 1.4,34.04 1.4,13.08 6.1,8.38 40.39,8.38 46.61,2.16 97.41,2.16 101.22,5.97 101.22,15.88 CN1.9 100.33,19.43 100.33,21.08 99.5,21.91 93.28,21.91 92.96,22.23 90.81,22.23 87.38,18.8 U1.11
IO5
  Top 0.254: CN1.11 97.73,19.37 94.68,19.37 93.34,20.7 90.42,20.7 87.25,17.53 U1.12
  Bottom 0.254: CN1.11 100.78,18.86 100.78,5.52 97.41,2.16 46.61,2.16 40.39,8.38 5.46,8.38 1.4,12.45 1.4,42.16 1.91,42.67 4,42.67 LED6.K
IO6
  Top 0.254: U1.13 89.03,16.26 89.66,15.62 89.66,9.27 LED37.K
IO7
  Top 0.254: U1.14 84.96,14.99 83.25,16.7 83.25,21.53 85.72,24 88.77,24 LED38.K
IO8
  Top 0.254: CN2.1 77.72,9.27 75.18,9.27 73.66,10.79 73.66,13.59 72.26,14.99 U2.3
  Bottom 0.254: LED7.K 11.3,11.68 12.57,10.41 41.27,10.41 47.5,4.19 75.18,4.19 CN2.1
IO9
  Top 0.254: U2.4 72.14,16.26 74.17,14.22 74.17,12.7 75.06,11.81 77.72,11.81 CN2.3
  Bottom 0.254: CN2.3 80.39,9.14 80.39,6.35 77.72,3.68 47.24,3.68 41.02,9.91 10.79,9.91 10.03,10.67 10.03,14.29 11.68,15.94 11.68,19.43 LED8.K
IO10
  Top 0.254: U2.5 72.14,17.53 75.31,14.35 77.72,14.35 CN2.5 80.39,11.68 80.39,7.24 78.36,5.21 47.88,5.21 41.72,11.37 13.91,11.37 12.57,12.7 12.57,24.51 11.24,25.84 LED9.K
IO11
  Top 0.254: U2.6 73.41,18.8 75.31,16.89 77.72,16.89 CN2.7 81.03,13.59 81.03,6.99 78.74,4.7 47.75,4.7 41.53,10.92 11.81,10.92 10.03,12.7 10.03,30.61 LED10.K
IO12
  Top 0.254: U2.11 67.56,18.8 69.47,20.7 72.64,20.7 73.91,19.43 77.72,19.43 CN2.9 81.53,15.62 81.53,6.6 79.12,4.19 47.5,4.19 41.27,10.41 9.4,10.41 7.43,12.38 7.43,34.1 11.24,37.91 LED11.K
IO13
  Top 0.254: LED12.K 6.99,39.62 6.99,12.06 9.14,9.91 41.02,9.91 47.24,3.68 79.5,3.68 82.04,6.22 82.04,17.65 CN2.11 77.72,21.97 75.31,21.97 74.68,22.61 71.37,22.61 70.23,21.46 69.6,21.46 67.56,19.43 65.09,19.43 64.77,19.11 64.77,17.84 65.09,17.53 U2.12
IO14
  Top 0.254: U2.13 68.83,16.26 69.34,15.75 69.34,9.4 LED39.K
IO15  (via drill 0.6)
  Top 0.254: U2.14 67.44,14.99 v67.69,14.99
  Bottom 0.254: v67.69,14.99 67.69,23.11 LED40.K
IO16
  Top 0.254: U3.3 52.2,14.99 53.72,13.46 53.72,11.43 55.88,9.27 58.04,9.27 CN3.1
  Bottom 0.254: LED13.K 18.92,13.84 20.45,12.32 42.04,12.32 47.75,6.6 57.91,6.6 CN3.1
IO17
  Top 0.254: U3.4 52.58,16.26 54.74,14.1 54.74,12.83 55.75,11.81 58.04,11.81 CN3.3 60.71,9.14 60.71,7.37 59.94,6.6 47.75,6.6 42.04,12.32 20.45,12.32 19.56,13.21 19.56,16.89 17.4,19.05 17.34,19.11 LED14.K
IO18
  Top 0.254: U3.5 52.7,17.53 55.88,14.35 58.04,14.35 CN3.5 61.34,11.05 61.34,6.99 60.2,5.84 47.88,5.84 41.91,11.81 14.1,11.81 13.02,12.89 13.02,21.53 LED15.K
IO19
  Top 0.254: U3.6 53.85,18.8 55.75,16.89 58.04,16.89 CN3.7
  Bottom 0.254: LED16.K 17.02,31.88 14.73,29.59 13.97,29.59 13.46,29.08 13.46,12.45 14.1,11.81 41.91,11.81 47.88,5.84 60.2,5.84 62.87,8.51 62.87,12.06 CN3.7
IO20
  Top 0.254: U3.11 47.12,18.8 49.02,20.7 54.36,20.7 55.63,19.43 58.04,19.43 CN3.9
  Bottom 0.254: LED17.K 14.99,35.56 13.59,35.56 13.02,34.99 13.02,12.19 13.84,11.37 41.72,11.37 47.88,5.21 60.33,5.21 63.5,8.38 63.5,13.97 CN3.9
IO21
  Top 0.254: U3.12 45.21,17.53 44.83,17.91 44.83,19.05 45.21,19.43 47.05,19.43 49.59,21.97 58.04,21.97 CN3.11 | LED18.K 17.27,43.94
  Bottom 0.254: CN3.11 64.14,15.88 64.14,8.38 60.45,4.7 47.75,4.7 41.53,10.92 13.59,10.92 12.57,11.94 12.57,41.78 13.34,42.55 15.94,42.55 LED18.K
IO22
  Top 0.254: U3.13 48.64,16.26 49.4,15.49 49.4,9.46 LED41.K
IO23  (via drill 0.6)
  Top 0.254: v48.51,14.99 U3.14
  Bottom 0.254: LED42.K 50.16,16.64 v48.51,14.99
IO24
  Top 0.254: U4.3 92.46,41.15 93.85,39.75 93.85,36.45 94.87,35.43 97.73,35.43 CN4.1 99.12,34.29 99.19,34.29 101.35,36.45 101.35,50.93 97.16,55.12 46.48,55.12 39.75,48.39 19.81,48.39 18.67,47.24 18.67,18.67 23.37,13.97 LED19.K
IO25
  Top 0.254: U4.4 92.33,42.42 94.74,40.01 94.74,38.48 95.25,37.97 97.73,37.97 CN4.3 99.06,36.7 100.84,38.48 100.84,50.67 96.9,54.61 46.61,54.61 39.88,47.88 20.07,47.88 19.11,46.93 19.11,24.07 LED20.K
IO26
  Top 0.254: U4.5 92.46,43.69 95.63,40.51 97.73,40.51 CN4.5 99.57,39.24 100.39,40.07 100.39,50.35 96.65,54.1 46.74,54.1 40.01,47.37 20.32,47.37 19.56,46.61 19.56,29.59 23.3,25.84 LED21.K
IO27
  Top 0.254: U4.6 93.22,44.96 95.12,43.05 97.73,43.05 CN4.7
  Bottom 0.254: LED22.K 23.37,35.69 22.99,36.07 20.13,36.07 19.11,37.08 19.11,47.24 20.26,48.39 39.75,48.39 46.48,55.12 101.47,55.12 102.87,53.72 102.87,45.66 CN4.7
IO28
  Top 0.254: CN4.9 97.73,45.59 95.38,45.59 94.11,46.86 90.04,46.86 89.28,46.1 89.28,45.59 88.65,44.96 U4.11
  Bottom 0.254: LED23.K 23.37,40.89 22.73,41.53 20.51,41.53 19.56,42.48 19.56,47.05 20.38,47.88 39.88,47.88 46.61,54.61 101.09,54.61 102.36,53.34 102.36,47.69 CN4.9
IO29
  Top 0.254: CN4.11 98.93,46.86 98.17,47.62 | 98.17,47.62 97.66,48.13 | U4.12 85.09,43.69 84.45,44.32 84.45,46.29 85.03,46.86 88.39,46.86 89.66,48.13 97.66,48.13 | 97.66,48.13 98.17,47.62
  Bottom 0.254: LED24.K 23.37,46.61 24.13,47.37 40.01,47.37 46.74,54.1 100.84,54.1 101.85,53.09 101.85,48.01 100.71,46.86 100.65,46.86 CN4.11
IO30
  Top 0.254: U4.13 87.25,42.42 88.08,43.24 88.9,43.24 89.34,42.8 89.34,35.69 LED43.K
IO31
  Top 0.254: LED44.K 90.17,51.69 88.77,50.29 85.34,50.29 82.8,47.75 82.8,42.16 83.82,41.15 U4.14
IO32
  Top 0.254: U5.3 72.52,41.15 73.79,39.88 73.79,36.96 75.31,35.43 77.72,35.43 CN5.1 75.95,31.11 47.12,31.11 37.21,41.02 26.54,41.02 25.78,40.26 24.64,39.12 24.64,18.67 29.4,13.91 LED25.K
IO33
  Top 0.254: U5.4 72.64,42.42 74.8,40.26 74.8,38.48 75.31,37.97 77.72,37.97 CN5.3 80.39,35.31 80.39,33.53 77.47,30.61 46.86,30.61 37.47,40.01 26.29,40.01 26.04,39.75 25.15,38.86 25.15,24.13 29.4,19.88 LED26.K
IO34
  Top 0.254: U5.5 72.26,43.69 75.44,40.51 77.72,40.51 CN5.5 80.9,37.34 80.9,33.27 77.72,30.1 46.61,30.1 37.47,39.24 26.23,39.24 25.59,38.61 25.59,29.65 LED27.K
IO35
  Top 0.254: U5.6 73.53,44.96 75.44,43.05 77.72,43.05 CN5.7 81.41,39.37 81.41,33.15 77.85,29.59 46.35,29.59 40.39,35.56 33.08,35.56 LED28.K
IO36
  Top 0.254: U5.11 68.07,44.96 69.98,46.86 74.04,46.86 75.31,45.59 77.72,45.59 CN5.9 81.92,41.4 81.92,32.89 78.11,29.08 46.1,29.08 40.13,35.05 33.66,35.05 30.86,32.26 30.86,31.11 30.23,30.48 28.83,30.48 28.13,31.18 28.13,36.64 LED29.K
IO37
  Top 0.254: CN5.11 77.98,47.88 | 77.98,47.88 77.72,48.13 | 65.15,43.69 64.64,44.2 64.64,46.48 65.02,46.86 68.58,46.86 69.85,48.13 77.72,48.13 | 65.15,43.69 U5.12 | LED30.K 29.4,43.88 31.11,42.16 | 31.11,42.16 31.37,41.91 | 65.15,43.69 64.64,43.18 64.64,33.27 62.99,31.62 47.37,31.62 37.08,41.91 31.37,41.91 | 31.37,41.91 31.11,42.16 | 77.72,48.13 77.98,47.88
IO38
  Top 0.254: LED45.K 69.98,37.72 68.58,39.12 68.58,41.53 67.69,42.42 U5.13
IO39  (via drill 0.6)
  Top 0.254: U5.14 67.31,41.15 v67.56,41.4 | LED46.K 69.98,51.82 68.71,53.09 66.42,53.09 63.25,49.91 v63.25,43.94
  Bottom 0.254: v63.25,43.94 65.53,41.66 65.79,41.4 v67.56,41.4
IO40
  Top 0.254: U6.3 52.83,41.15 54.48,39.5 54.48,36.45 55.5,35.43 58.04,35.43 CN6.1
  Bottom 0.254: CN6.1 59.31,33.15 55.5,29.34 47.37,29.34 44.07,26.04 44.07,22.48 LED31.K
IO41
  Top 0.254: U6.4 52.83,42.42 54.99,40.26 54.99,38.86 55.88,37.97 58.04,37.97 CN6.3
  Bottom 0.254: LED32.K 37.08,19.81 37.21,19.94 47.12,29.84 54.99,29.84 57.91,32.77 57.91,35.31 CN6.3
IO42
  Top 0.254: U6.5 52.58,43.69 55.75,40.51 58.04,40.51 CN6.5
  Bottom 0.254: LED33.K 38.29,25.84 42.23,25.84 42.55,26.16 46.86,30.48 52.7,30.48 55.24,33.02 55.24,37.34 55.88,37.97 58.04,37.97 CN6.5
IO43
  Top 0.254: U6.6 53.85,44.96 55.75,43.05 58.04,43.05 CN6.7
  Bottom 0.254: LED34.K 36.32,30.99 52.58,30.99 54.74,33.15 54.74,39.5 55.75,40.51 58.04,40.51 CN6.7
IO44
  Top 0.254: CN6.9 58.04,45.59 54.74,45.59 53.47,46.86 50.29,46.86 48.39,44.96 U6.11
  Bottom 0.254: CN6.9 58.04,43.05 55.75,43.05 54.1,41.4 54.1,33.15 52.45,31.5 41.85,31.5 37.85,31.5 36.83,32.51 36.83,36.51 LED35.K
IO45
  Top 0.254: CN6.11 59.18,46.86 57.91,48.13 54.48,48.13 51.94,48.13 49.91,48.13 47.37,45.59 44.96,45.59 44.45,45.09 44.45,44.45 | 44.45,44.45 44.45,44.32 45.09,43.69 U6.12 | LED36.K 43.94,43.94 44.45,44.45
IO46
  Top 0.254: U6.13 47.88,42.42 49.02,41.27 49.02,36.01 LED47.K
IO47  (via drill 0.6)
  Top 0.254: U6.14 44.96,41.15 v43.43,42.67
  Bottom 0.254: v43.43,42.67 43.43,44.7 46.86,48.13 49.66,48.13 50.16,48.64 LED48.K
LATCH  (via drill 0.6)
  Top 0.254: v71.12,23.62 67.56,20.07 U2.10 63.63,20.07 61.72,21.97 58.8,21.97 57.91,22.86 57.91,23.75 57.02,24.64 51.56,24.64 46.99,20.07 U3.10 40.89,20.07 39.24,21.72 v39.24,33.15 | TP12.P$1 v85.09,25.78 | v102.23,25.53 93.22,25.53 90.68,22.99 v87.88,22.99 87.88,20.95 87,20.07 U1.10 | v87.76,45.85 87.38,46.23 U4.10 | U5.10 67.31,46.23 v67.56,45.97 | v62.23,50.8 51.82,50.8 47.24,46.23 U6.10 v42.29,46.23
  Bottom 0.254: v71.12,23.62 71.88,23.62 74.04,25.78 v85.09,25.78 85.09,24 86.11,22.99 v87.88,22.99 | CN7.10 106.05,23.24 103.76,25.53 v102.23,25.53 | CN8.10 102.23,40.51 89.28,40.51 87.76,42.04 v87.76,45.85 85.22,48.39 82.3,48.39 79.5,45.59 74.04,45.59 73.41,44.96 68.58,44.96 v67.56,45.97 67.06,45.97 66.93,46.1 v62.23,50.8 | v39.24,33.15 39.24,43.18 v42.29,46.23
LED1_R
  Bottom 0.254: R1.1 2.39,14.12 LED1.A
LED2_R
  Bottom 0.254: R2.1 2.39,20.15 LED2.A
LED3_R
  Bottom 0.254: R3.1 2.39,26.19 LED3.A
LED4_R
  Bottom 0.254: R4.1 2.39,32.22 LED4.A
LED5_R
  Bottom 0.254: R5.1 2.39,38.25 LED5.A
LED6_R
  Bottom 0.254: R6.1 2.39,44.28 LED6.A
LED7_R
  Bottom 0.254: R9.1 8.42,14.12 LED7.A
LED8_R
  Bottom 0.254: R10.1 8.42,20.15 LED8.A
LED9_R
  Bottom 0.254: R11.1 8.42,26.19 LED9.A
LED10_R
  Bottom 0.254: R12.1 8.42,32.22 LED10.A
LED11_R
  Bottom 0.254: R13.1 8.42,38.25 LED11.A
LED12_R
  Bottom 0.254: R14.1 8.42,44.28 LED12.A
LED13_R
  Bottom 0.254: R17.1 14.45,14.19 LED13.A
LED14_R
  Bottom 0.254: R18.1 14.45,20.15 LED14.A
LED15_R
  Bottom 0.254: R19.1 14.45,26.19 LED15.A
LED16_R
  Bottom 0.254: R20.1 14.45,32.22 LED16.A
LED17_R
  Bottom 0.254: R21.1 14.45,38.25 LED17.A
LED18_R
  Bottom 0.254: R22.1 14.45,44.28 LED18.A
LED19_R
  Bottom 0.254: R25.1 20.49,14.19 LED19.A
LED20_R
  Bottom 0.254: R26.1 20.49,20.15 LED20.A
LED21_R
  Bottom 0.254: R27.1 20.49,26.19 LED21.A
LED22_R
  Bottom 0.254: R28.1 20.49,32.22 LED22.A
LED23_R
  Bottom 0.254: R29.1 20.49,38.25 LED23.A
LED24_R
  Bottom 0.254: R30.1 20.49,44.28 LED24.A
LED25_R
  Bottom 0.254: R33.1 26.52,14.19 LED25.A
LED26_R
  Bottom 0.254: R34.1 26.52,20.15 LED26.A
LED27_R
  Bottom 0.254: R35.1 26.52,26.19 LED27.A
LED28_R
  Bottom 0.254: R36.1 26.52,32.22 LED28.A
LED29_R
  Bottom 0.254: R37.1 26.52,38.25 LED29.A
LED30_R
  Bottom 0.254: R38.1 26.52,44.28 LED30.A
LED31_R
  Bottom 0.254: R41.1 32.55,14.19 LED31.A
LED32_R
  Bottom 0.254: R42.1 32.55,20.15 LED32.A
LED33_R
  Bottom 0.254: R43.1 32.55,26.19 LED33.A
LED34_R
  Bottom 0.254: R44.1 32.55,32.22 LED34.A
LED35_R
  Bottom 0.254: R45.1 32.55,38.25 LED35.A
LED36_R
  Bottom 0.254: R46.1 32.55,44.28 LED36.A
LED37_R
  Bottom 0.254: R7.1 87.29,9.11 LED37.A
LED38_R
  Bottom 0.254: R8.1 89.05,26.82 LED38.A
LED39_R
  Bottom 0.254: R15.1 67.09,9.11 LED39.A
LED40_R
  Bottom 0.254: R16.1 67.09,25.74 LED40.A
LED41_R
  Bottom 0.254: R23.1 47.28,9.04 LED41.A
LED42_R
  Bottom 0.254: R24.1 48.05,25.82 LED42.A
LED43_R
  Bottom 0.254: R31.1 88.99,36.22 LED43.A
LED44_R
  Bottom 0.254: R32.1 87.22,51.35 LED44.A
LED45_R
  Bottom 0.254: R39.1 67.16,35.14 LED45.A
LED46_R
  Bottom 0.254: R40.1 67.09,51.41 LED46.A
LED47_R
  Bottom 0.254: R47.1 47.6,34.89 LED47.A
LED48_R
  Bottom 0.254: R48.1 47.22,51.22 LED48.A
LED49_R
  Bottom 0.254: R49.1 LED49.A

### Text on the board
tPlace: Channel 5 | LaserBox Mux Board | Channel 3 | DAT OUT | Status / 5 1 | Status / 4 1 | Status / 3 1 | Out | DAT 5-6 | DAT 4-5 | Output Status | 0 | 1 | 2 | 3 | 4 | 5 | 5 | LEDs / Active | 4 | GND | Status / 5 0 | Status / 4 1 | Status | 3 1 | 3 | GND | Power | 2 | Status / 2 1 | Status / 1 1 | LAT | 0 0 | DAT 3-4 | DAT 2-3 | DAT 1-2 | 1 | 0 | CLK | Rev001 | Status / 2 0 | Status / 1 0 | 0 1 | In | DAT IN | +5V | Channel 2 | Channel 1 | Channel 0
bPlace: Designed by sen | Released under Creative Commons Attribution-ShareAlike 3.0 | LAT | CLK | GND | +5V | +5V | +5V | OUT | +5V | LAT | 5 | CLK | GND | 4 | +5V | GND | 3 | +5V | OUT | 2 | +5V | IN | http://hackstrich.sen.cx/LaserBox/Mux_Board | 1 | 0 | I/O | Serial